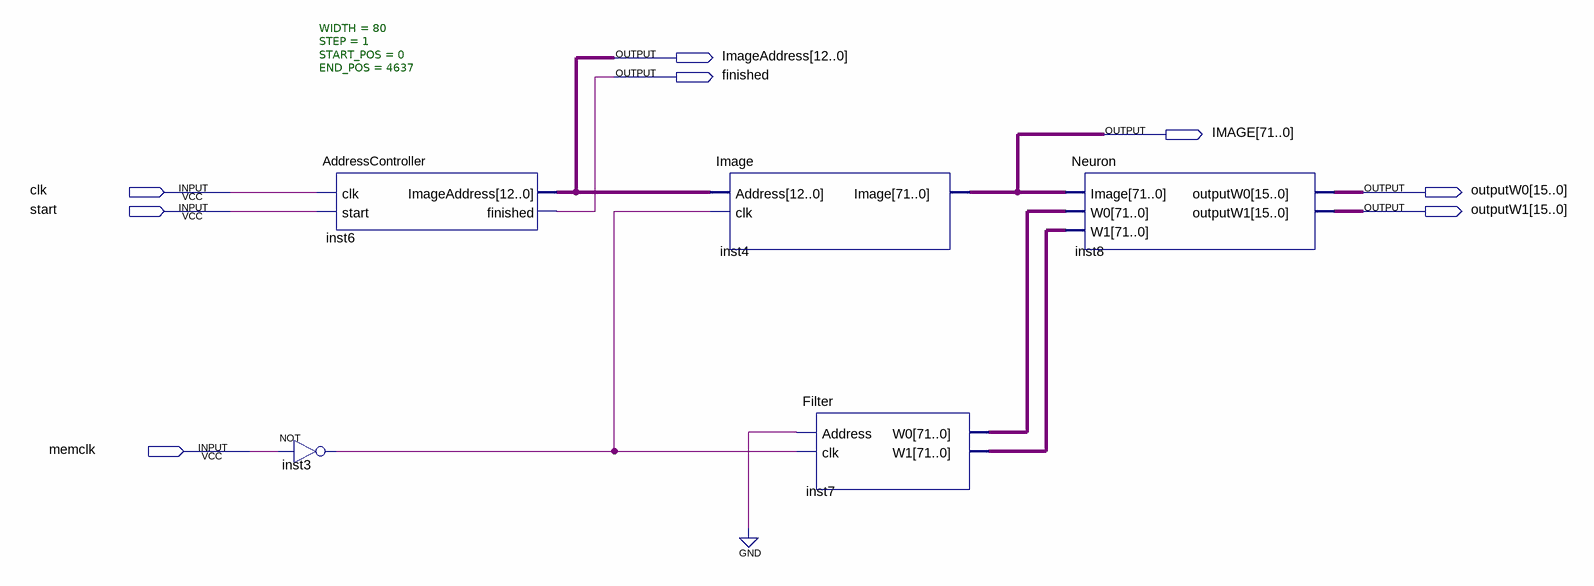
[diagram p0: schematic sheet]
// Quartus schematic CNN_Layer.bdf as structural Verilog: 5 symbols, 8 pins
module CNN_Layer (
  input  clk,
  input  start,
  input  memclk,
  output [12:0] ImageAddress,
  output finished,
  output [71:0] IMAGE,
  output [15:0] outputW0,
  output [15:0] outputW1
);

  wire inst3_out;
  wire [71:0] inst7_w0, inst7_w1;

  AddressController #(.WIDTH(80), .STEP(1), .START_POS(0), .END_POS(4637)) inst6 (
    .clk(clk), .start(start), .ImageAddress(ImageAddress), .finished(finished));
  not inst3 (inst3_out, memclk);
  Image inst4 (.Address(ImageAddress), .clk(inst3_out), .Image(IMAGE));
  Filter inst7 (.Address(1'b0), .clk(inst3_out), .W0(inst7_w0), .W1(inst7_w1));
  Neuron inst8 (.Image(IMAGE), .W0(inst7_w0), .W1(inst7_w1), .outputW0(outputW0), .outputW1(outputW1));
endmodule
